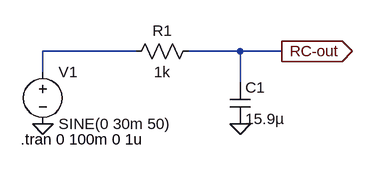
[diagram p0: schematic filters.asc]
filters.asc, the LTspice schematic file:
Version 4
SHEET 1 880 680
WIRE 128 64 -16 64
WIRE 288 64 208 64
WIRE 352 64 288 64
WIRE -16 96 -16 64
WIRE 288 112 288 64
FLAG -16 176 0
FLAG 288 176 0
FLAG 352 64 RC-out
IOPIN 352 64 Out
SYMBOL voltage -16 80 R0
WINDOW 123 0 0 Left 0
WINDOW 39 0 0 Left 0
SYMATTR InstName V1
SYMATTR Value SINE(0 30m 50)
SYMBOL res 224 48 R90
WINDOW 0 0 56 VBottom 2
WINDOW 3 32 56 VTop 2
SYMATTR InstName R1
SYMATTR Value 1k
SYMBOL cap 272 112 R0
SYMATTR InstName C1
SYMATTR Value 15.9µ
TEXT -50 200 Left 2 !.tran 0 100m 0 1u

The netlist it stands for:
* filters.asc
V1 N001 0 SINE(0 30m 50)
R1 RC-out N001 1k
C1 RC-out 0 15.9µ
.tran 0 100m 0 1u
.backanno
.end